# EAGLE design Motherboard (EAGLE 9.3.1)
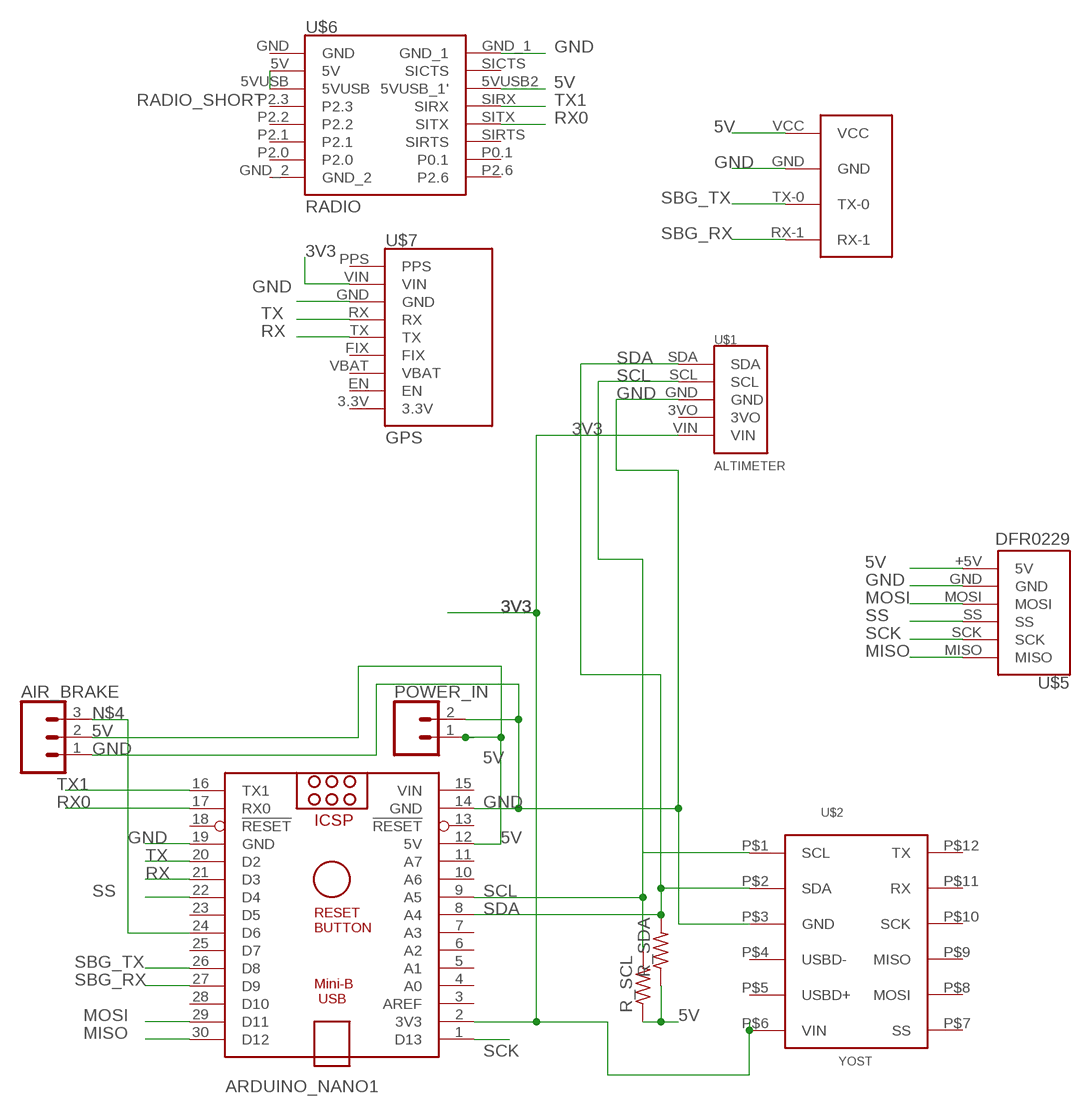
[diagram p0: schematic, sheet 1]

## Parts
AIR_BRAKE  CONN_03  [1X03]
ARDUINO_NANO1  ARDUINO_NANO  [ARDUINO_NANO]
POWER_IN  CONN_023.5MM  [SCREWTERMINAL-3.5MM-2]
R_SCL  R-US_R0603  [R0603]
R_SDA  R-US_R0603  [R0603]
U$1  ALTIMETER  [ALTIMETER]
U$2  YOST  [YOST]
U$3  RS232  [RS232]
U$5  DFR0229  [DFR0229]
U$6  RADIO  [RADIO]
U$7  GPS  [GPS]

## Nets
3V3: ARDUINO_NANO1.2(3V3) U$1.VIN U$2.P$6(VIN) U$7.VIN
5V: AIR_BRAKE.2 ARDUINO_NANO1.12(5V) POWER_IN.1 R_SCL.1 R_SDA.1 U$3.VCC U$5.+5V(5V) U$6.5VUSB2(5VUSB_1')
GND: AIR_BRAKE.1 ARDUINO_NANO1.14(GND) ARDUINO_NANO1.19(GND) POWER_IN.2 U$1.GND U$2.P$3(GND) U$3.GND U$5.GND U$6.GND_1 U$7.GND
MISO: ARDUINO_NANO1.30(D12) U$5.MISO
MOSI: ARDUINO_NANO1.29(D11) U$5.MOSI
N$4: AIR_BRAKE.3 ARDUINO_NANO1.24(D6)
RADIO_SHORT: U$6.5V U$6.5VUSB
RX: ARDUINO_NANO1.21(D3) U$7.TX
RX0: ARDUINO_NANO1.17(RX0) U$6.SITX
SBG_RX: ARDUINO_NANO1.27(D9) U$3.RX-1
SBG_TX: ARDUINO_NANO1.26(D8) U$3.TX-0
SCK: ARDUINO_NANO1.1(D13) U$5.SCK
SCL: ARDUINO_NANO1.9(A5) R_SCL.2 U$1.SCL U$2.P$1(SCL)
SDA: ARDUINO_NANO1.8(A4) R_SDA.2 U$1.SDA U$2.P$2(SDA)
SS: ARDUINO_NANO1.22(D4) U$5.SS
TX: ARDUINO_NANO1.20(D2) U$7.RX
TX1: ARDUINO_NANO1.16(TX1) U$6.SIRX
Unconnected: ARDUINO_NANO1.3(AREF) ARDUINO_NANO1.4(A0) ARDUINO_NANO1.5(A1) ARDUINO_NANO1.6(A2) ARDUINO_NANO1.7(A3) ARDUINO_NANO1.10(A6) ARDUINO_NANO1.11(A7) ARDUINO_NANO1.13(!RESET) ARDUINO_NANO1.18(!RESET) ARDUINO_NANO1.23(D5) ARDUINO_NANO1.25(D7) ARDUINO_NANO1.28(D10) U$1.3VO U$2.P$4(USBD-) U$2.P$5(USBD+) U$2.P$7(SS) U$2.P$8(MOSI) U$2.P$9(MISO) U$2.P$10(SCK) U$2.P$11(RX) U$2.P$12(TX) U$6.GND U$6.GND_2 U$6.P0.1 U$6.P2.0 U$6.P2.1 U$6.P2.2 U$6.P2.3 U$6.P2.6 U$6.SICTS U$6.SIRTS U$7.3.3V U$7.EN U$7.FIX U$7.PPS U$7.VBAT

## Power pins joined to a net without a drawn wire
VIN: ARDUINO_NANO1.15(VIN)

## Library data of the parts
AIR_BRAKE = SparkFun-Connectors:CONN_03: Multi connection point. Often used as Generic Header-pin footprint for 0.1 inch spaced/style header connections On any of the 0.1 inch spaced packages, you can populate with these: Break Away Headers - Straight <https://www.sparkfun.com/products/116> (PRT-00116) Break Away Male Headers - Right Angle <https://www.sparkfun.com/products/553> (PRT-00553) Female Headers <https://www.sparkfun.com/products/115> (PRT-00115) Break Away Headers - Machine Pin <https://www.sparkfun.com/products/117> (PRT-00117) Break Away Female Headers - Swiss Machine Pin <https://www.sparkfun.com/products/743> (PRT-00743) Stackable Header - 3 Pin (Female, 0.1") <https://www.sparkfun.com/products/13875> (PRT-13875) For SCREWTERMINALS and SPRING TERMINALS visit here: Screw Terimnals on SparkFun.com <https://www.sparkfun.com/search/results?term=Screw+Terminals> (5mm/3.5mm/2.54mm spacing) This device is also useful as a general connection point to wire up your design to another part of your project. Our various solder wires solder well into these plated through hole pads. Hook-Up Wire - Assortment (Stranded, 22 AWG) <https://www.sparkfun.com/products/11375> (PRT-11375) Hook-Up Wire - Assortment (Solid Core, 22 AWG) <https://www.sparkfun.com/products/11367> (PRT-11367) View the entire wire category on our website here <https://www.sparkfun.com/categories/141> Special notes: Molex polarized connector foot print use with SKU : PRT-08232 with associated crimp pins and housings.; PROD_ID: XXX-00000; VALUE: 455-1750-1-ND
ARDUINO_NANO1 = ArduinoNanoV30:ARDUINO_NANO: Arduino Nano V3.0 Overview: The Arduino Nano is a small, complete, and breadboard-friendly board based on the ATmega328 (Arduino Nano 3.x) or ATmega168 (Arduino Nano 2.x). It has more or less the same functionality of the Arduino Duemilanove, but in a different package. It lacks only a DC power jack, and works with a Mini-B USB cable instead of a standard one. The Nano was designed and is being produced by Gravitech. Specifications: Microcontroller Atmel ATmega168 or ATmega328 Operating Voltage (logic level) 5 V Input Voltage (recommended) 7-12 V Input Voltage (limits) 6-20 V Digital I/O Pins 14 (of which 6 provide PWM output) Analog Input Pins 8 DC Current per I/O Pin 40 mA Flash Memory 16 KB (ATmega168) or 32 KB (ATmega328) of which 2 KB used by bootloader SRAM 1 KB (ATmega168) or 2 KB (ATmega328) EEPROM 512 bytes (ATmega168) or 1 KB (ATmega328) Clock Speed 16 MHz Dimensions 0.73" x 1.70" Length 45 mm Width 18 mm Weigth 5 g Power: The Arduino Nano can be powered via the Mini-B USB connection, 6-20V unregulated external power supply (pin 30), or 5V regulated external power supply (pin 27). The power source is automatically selected to the highest voltage source. Memory: The ATmega168 has 16 KB of flash memory for storing code (of which 2 KB is used for the bootloader); the ATmega328 has 32 KB, (also with 2 KB used for the bootloader). The ATmega168 has 1 KB of SRAM and 512 bytes of EEPROM (which can be read and written with the EEPROM library); the ATmega328 has 2 KB of SRAM and 1 KB of EEPROM. Input and Output: Each of the 14 digital pins on the Nano can be used as an input or output, using pinMode(), digitalWrite(), and digitalRead() functions. They operate at 5 volts. Each pin can provide or receive a maximum of 40 mA and has an internal pull-up resistor (disconnected by default) of 20-50 kOhms. In addition, some pins have specialized functions. Visit Arduino - ArduinoBoardNano <https://www.arduino.cc/en/Main/ArduinoBoardNano>
POWER_IN = SparkFun-Connectors:CONN_02: Multi connection point. Often used as Generic Header-pin footprint for 0.1 inch spaced/style header connections On any of the 0.1 inch spaced packages, you can populate with these: Break Away Headers - Straight <https://www.sparkfun.com/products/116> (PRT-00116) Break Away Male Headers - Right Angle <https://www.sparkfun.com/products/553> (PRT-00553) Female Headers <https://www.sparkfun.com/products/115> (PRT-00115) Break Away Headers - Machine Pin <https://www.sparkfun.com/products/117> (PRT-00117) Break Away Female Headers - Swiss Machine Pin <https://www.sparkfun.com/products/743> (PRT-00743) For SCREWTERMINALS and SPRING TERMINALS visit here: Screw Terimnals on SparkFun.com <https://www.sparkfun.com/search/results?term=Screw+Terminals> (5mm/3.5mm/2.54mm spacing) This device is also useful as a general connection point to wire up your design to another part of your project. Our various solder wires solder well into these plated through hole pads. Hook-Up Wire - Assortment (Stranded, 22 AWG) <https://www.sparkfun.com/products/11375> (PRT-11375) Hook-Up Wire - Assortment (Solid Core, 22 AWG) <https://www.sparkfun.com/products/11367> (PRT-11367) View the entire wire category on our website here <https://www.sparkfun.com/categories/141> Special notes: Molex polarized connector foot print use with: PRT-08233 with associated crimp pins and housings. 2.54_SCREWTERM for use with PRT-10571. 3.5mm Screw Terminal footprints for PRT-08084 5mm Screw Terminal footprints for use with PRT-08432; PROD_ID: CONN-08399
R_SCL R_SDA = rcl:R-US_: RESISTOR, American symbol; SPICEPREFIX: R
U$1 = uORocketry-parts:ALTIMETER
U$2 = ArduinoNanoV30:YOST
U$3 = uORocketry-parts:RS232
U$5 = uORocketry-parts:DFR0229
U$6 = uORocketry-parts:RADIO
U$7 = uORocketry-parts:GPS: Adafruit ultimate GPS breakout

## Board
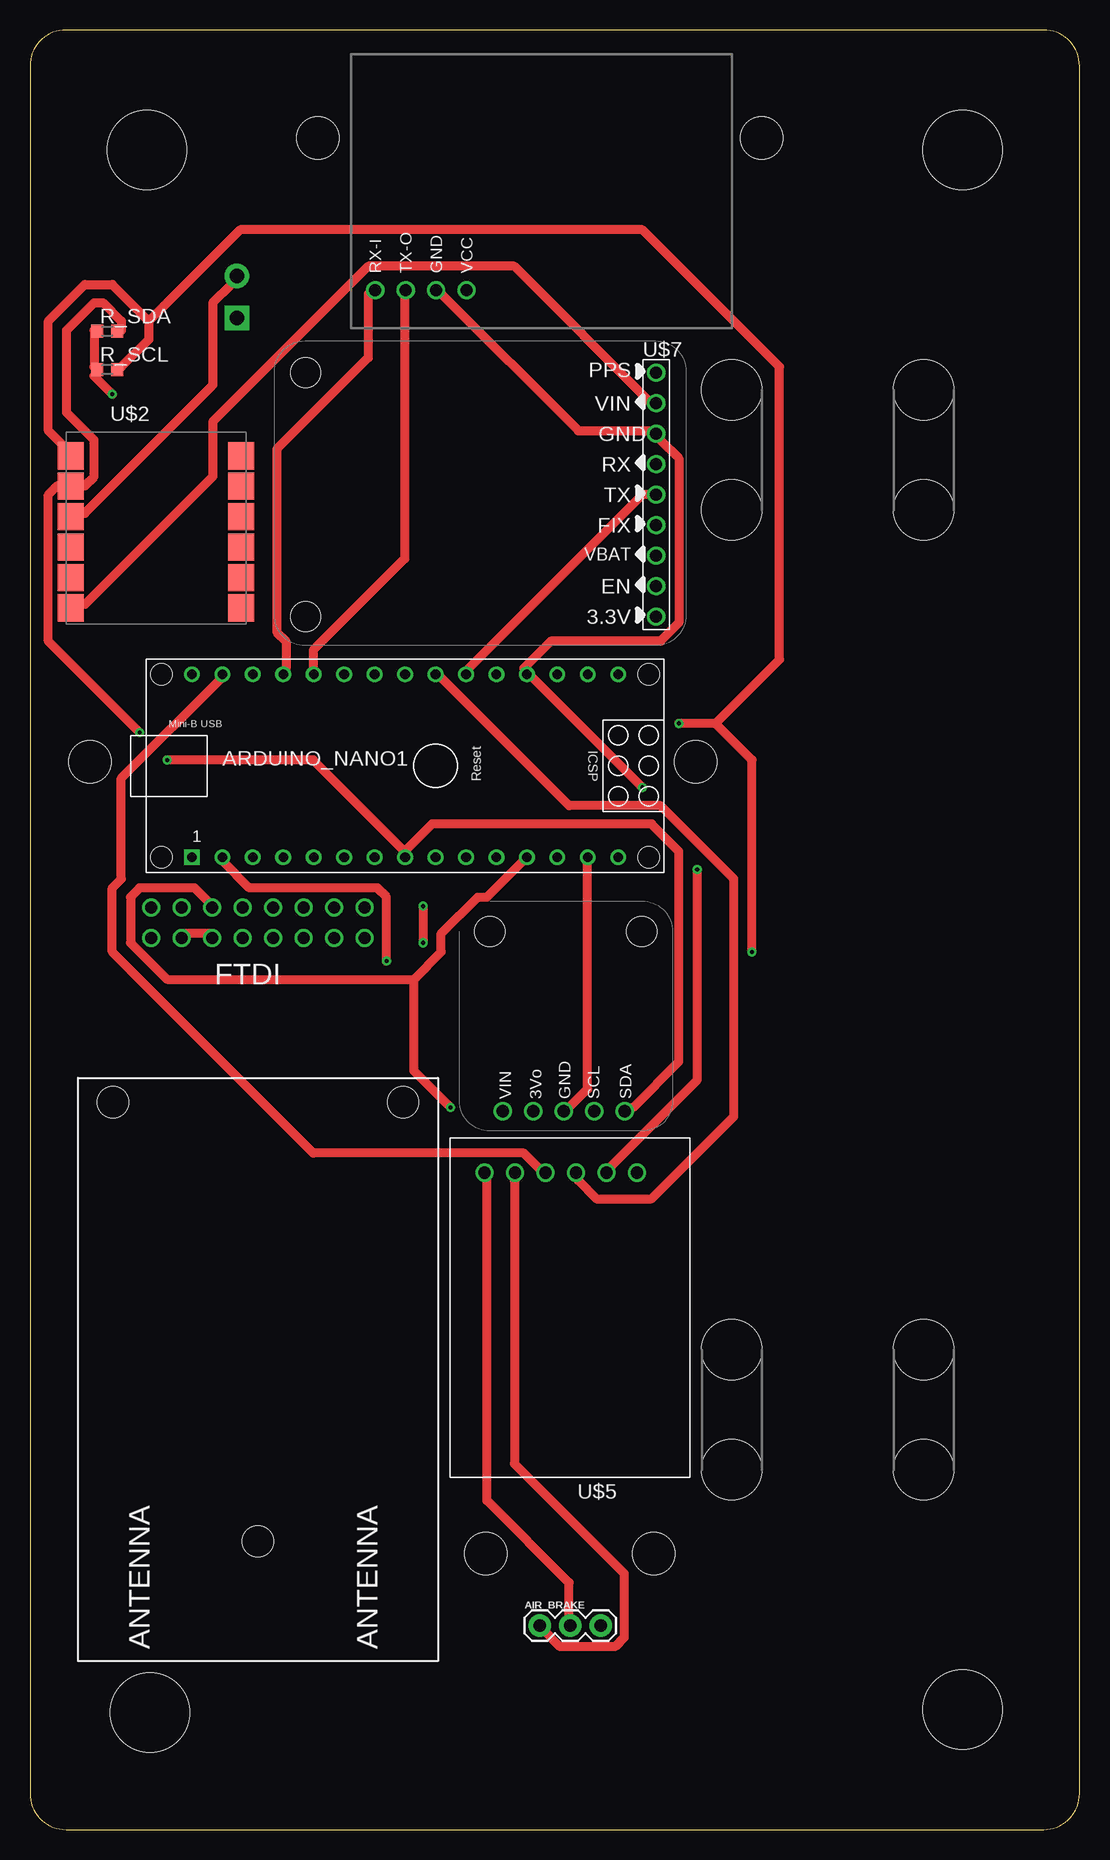
[diagram p1: board, top side]
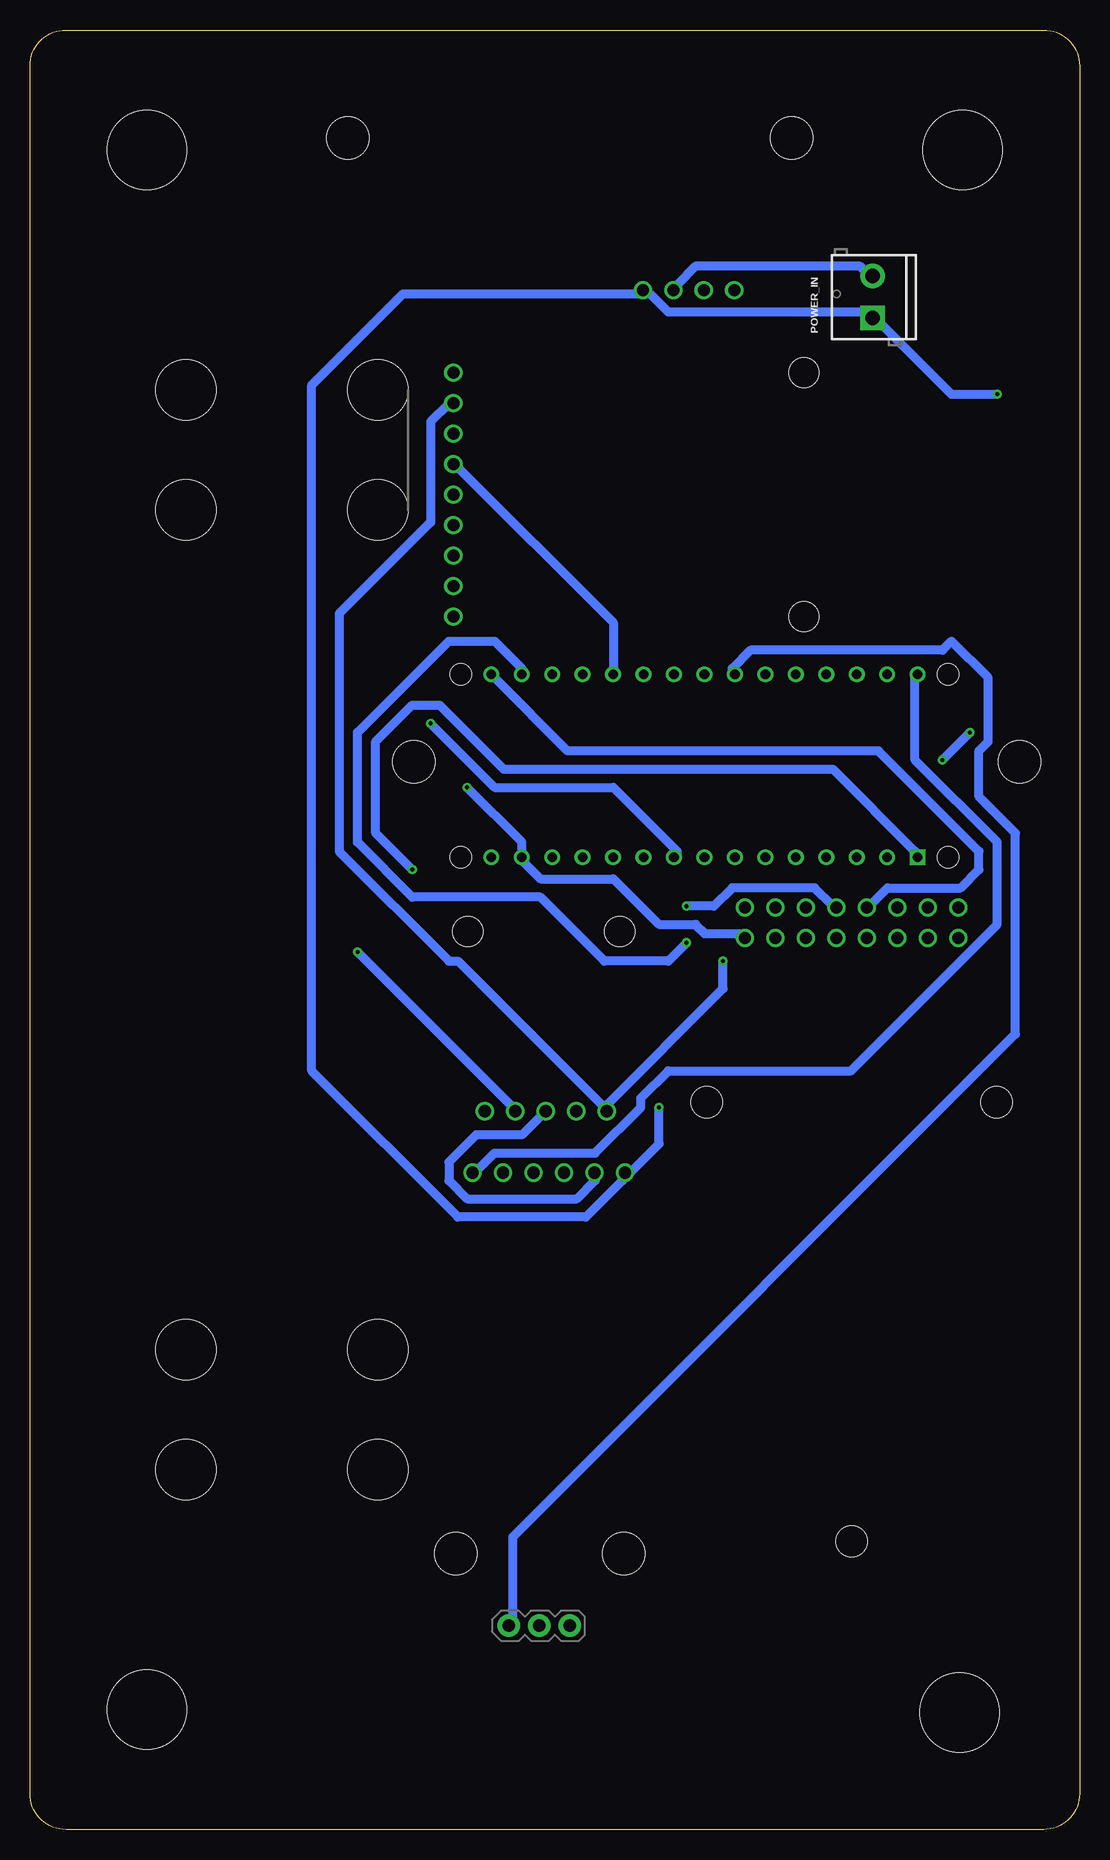
[diagram p2: board, bottom side, seen from below]

Size 87.5 x 150 mm. Coordinates in mm from the lower left corner, seen from the top.
Outline: 3,0 84.5,0 arc90 87.5,3 87.5,147 arc90 84.5,150 3,150 arc90 0,147 0,3 arc90 3,0
Copper layers (1*16): Top 0.035mm / dielectric 1.5mm / Bottom 0.035mm
Design rules "default *": minimum track width 30mil, minimum drill 0.35mm, track to track 30mil, track to pad 12mil, pad to pad 12mil, via to via 12mil, smd to smd 12mil, copper to edge 30mil, drill to drill 12mil, minimum pad ring 10mil, minimum via ring 8mil, stop-mask expansion 4mil, vias tented up to drill 0mil, thermal gap 10mil
Holes 6.6 mm at 9.75,140 10,9.75 77.75,10 77.75,140
Holes 3.54 mm at 52,23 38,23 5,89 55.5,89 24,141 61,141
Holes 5 mm at 58.5,40 58.5,30 74.5,40 74.5,30 58.5,120 74.5,120 74.5,110 58.5,110

### Footprints (pad centres in the part's own frame; a part is rotated, then mirrored left to right if it is on the bottom)
1X03 = drill 1.016 pad 1.88: 1 0,0; 2 2.54,0; 3 5.08,0
ARDUINO_NANO = drill 0.8 square: 1 -20.32,-7.62 | drill 0.8: 2 -17.78,-7.62; 3 -15.24,-7.62; 4 -12.7,-7.62; 5 -10.16,-7.62; 6 -7.62,-7.62; 7 -5.08,-7.62; 8 -2.54,-7.62; 9 0,-7.62; 10 2.54,-7.62; 11 5.08,-7.62; 12 7.62,-7.62; 13 10.16,-7.62; 14 12.7,-7.62; 15 15.24,-7.62; 16 15.24,7.62; 17 12.7,7.62; 18 10.16,7.62; 19 7.62,7.62; 20 5.08,7.62; 21 2.54,7.62; 22 0,7.62; 23 -2.54,7.62; 24 -5.08,7.62; 25 -7.62,7.62; 26 -10.16,7.62; 27 -12.7,7.62; 28 -15.24,7.62; 29 -17.78,7.62; 30 -20.32,7.62 | hole 1.778: -22.86,-7.62; -22.86,7.62; 17.78,7.62; 17.78,-7.62
SCREWTERMINAL-3.5MM-2 = drill 1.2 pad 2.032 square: 1 0,0 | drill 1.2 pad 2.032: 2 3.5,0
R0603 = smd 1 x 1.1: 1 -0.85,0; 2 0.85,0
ALTIMETER = drill 1.016: 3VO 7.62,-2.54; GND 7.62,0; SCL 7.62,2.54; SDA 7.62,5.08; VIN 7.62,-5.08 | hole 2.5: -7.347,6.5; -7.347,-6.16
YOST = smd 2.159 x 2.286: P$1 -7.112,6.017; P$2 -7.112,3.477; P$3 -7.112,0.937; P$4 -7.112,-1.603; P$5 -7.112,-4.143; P$6 -7.112,-6.683; P$7 7.112,-6.683; P$8 7.112,-4.143; P$9 7.112,-1.603; P$10 7.112,0.937; P$11 7.112,3.477; P$12 7.112,6.017
RS232 = drill 1.016: GND 19.685,7.112; RX-1 19.685,2.032; TX-0 19.685,4.572; VCC 19.685,9.652
DFR0229 = drill 1.016: +5V 7.1,-11.25; GND 4.56,-11.25; MISO -5.6,-11.25; MOSI 2.02,-11.25; SCK -3.06,-11.25; SS -0.52,-11.25
RADIO = drill 1.016: 5V 50.31,6.35; 5VUSB 50.31,3.81; 5VUSB2 52.85,3.81; GND 50.31,8.89; GND_1 50.31,-8.89; GND_2 52.85,8.89; P0.1 52.85,-6.35; P2.0 50.31,-6.35; P2.1 50.31,-3.81; P2.2 50.31,-1.27; P2.3 50.31,1.27; P2.6 52.85,-8.89; SICTS 52.85,6.35; SIRTS 52.85,-3.81; SIRX 52.85,1.27; SITX 52.85,-1.27 | hole 2.6: 0.02,0; 36.63,12.1; 36.63,-12.1
GPS = drill 1.016: 3.3V 14.7,-10.89; EN 14.7,-8.35; FIX 14.7,-3.27; GND 14.7,4.35; PPS 14.7,9.43; RX 14.7,1.81; TX 14.7,-0.73; VBAT 14.7,-5.81; VIN 14.7,6.89 | hole 2.5: -14.51,9.43; -14.51,-10.89

### Placement (x,y rotation side)
AIR_BRAKE  42.5,17 0 top
ARDUINO_NANO1  33.81,88.66 0 top
POWER_IN  17.25,126 90 bottom
R_SCL  6.44,121.7 0 top
R_SDA  6.44,124.89 0 top
U$1  44.5,67.5 270 top
U$2  10.5,108.5 0 top
U$3  26.75,148 270 top
U$5  45,43.5 180 top
U$6  19,24 90 top
U$7  37.5,112 0 top

### Tracks (layer width: path | path; a pad name or v marks a point on that pad's centre or on a via)
3V3  (via drill 0.35)
  Top 0.762: v29.72,72.39 29.72,77.72 28.96,78.49 18.29,78.49 16,80.77 ARDUINO_NANO1.2 | U$2.P$6 3.81,102.11 4.57,102.11 15.24,112.78 15.24,117.35 28.19,130.3 40.39,130.3 51.82,118.87 U$7.VIN
  Bottom 0.762: v29.72,72.39 29.72,70.1 39.62,60.2 | 39.62,60.2 51.82,72.39 52.58,72.39 61.72,81.53 61.72,101.35 54.1,108.97 54.1,117.35 52.58,118.87 U$7.VIN | 39.62,60.2 U$1.VIN
5V  (via drill 0.35)
  Top 0.762: 32,70.87 34.29,73.15 34.29,74.68 37.34,77.72 38.1,77.72 41.15,80.77 ARDUINO_NANO1.12 | 32,70.87 11.43,70.87 8.38,73.91 8.38,77.72 9.14,78.49 13.72,78.49 15.24,76.96 U$6.5VUSB2 | R_SDA.1 5.33,124.97 5.33,121.92 R_SCL.1 5.33,121.16 v6.86,119.63 | U$5.+5V 38.1,54.1 38.1,27.43 44.96,20.57 44.96,17.53 AIR_BRAKE.2 | 32,70.87 32,63.25 v35.05,60.2
  Bottom 0.762: v6.86,119.63 10.67,119.63 16.76,125.73 POWER_IN.1 17.53,126.49 34.29,126.49 35.81,128.02 U$3.VCC 36.58,128.02 56.39,128.02 64.01,120.4 64.01,63.25 51.82,51.05 41.15,51.05 38.1,54.1 U$5.+5V 37.34,54.86 35.05,57.15 v35.05,60.2
GND  (via drill 0.35)
  Top 0.762: U$2.P$3 3.81,109.73 4.57,109.73 15.24,120.4 15.24,127.25 16.76,128.78 POWER_IN.2 | U$3.GND 34.29,128.02 45.72,116.59 51.82,116.59 U$7.GND 52.58,115.82 54.1,114.3 54.1,100.58 52.58,99.06 43.43,99.06 41.15,96.77 ARDUINO_NANO1.19 41.91,96.01 v51.05,86.87 | ARDUINO_NANO1.14 46.48,80.77 46.48,61.72 44.96,60.2 U$1.GND | AIR_BRAKE.1 42.67,16.76 44.2,15.24 48.77,15.24 49.53,16 49.53,21.34 40.39,30.48 40.39,54.1 U$5.GND
  Bottom 0.762: U$3.GND 33.53,128.78 32,130.3 18.29,130.3 17.53,129.54 POWER_IN.2 | U$5.GND 40.39,54.1 41.91,52.58 51.05,52.58 52.58,54.1 52.58,55.63 50.29,57.91 46.48,57.91 44.96,59.44 U$1.GND | U$6.GND_1 28.19,74.68 31.24,74.68 32,75.44 35.05,75.44 38.86,79.25 44.96,79.25 46.48,80.77 ARDUINO_NANO1.14 46.48,81.53 46.48,82.3 v51.05,86.87
MISO
  Bottom 0.762: ARDUINO_NANO1.30 13.72,96.01 13.72,89.15 6.86,82.3 6.86,75.44 19.05,63.25 34.29,63.25 36.58,60.96 36.58,60.2 40.39,56.39 48.77,56.39 50.29,54.86 U$5.MISO
MOSI
  Top 0.762: ARDUINO_NANO1.29 16,96.01 7.62,87.63 7.62,79.25 6.86,78.49 6.86,73.15 23.62,56.39 41.15,56.39 42.67,54.86 U$5.MOSI
N$4
  Bottom 0.762: ARDUINO_NANO1.24 28.96,96.77 27.43,98.3 11.43,98.3 10.67,99.06 7.62,96.01 7.62,90.68 8.38,89.92 8.38,86.11 5.33,83.06 5.33,66.29 47.24,24.38 47.24,17.53 AIR_BRAKE.3
RADIO_SHORT
  Top 0.762: U$6.5V 12.95,74.68 15.24,74.68 U$6.5VUSB
RX
  Top 0.762: ARDUINO_NANO1.21 36.58,96.77 51.05,111.25 51.82,111.25 U$7.TX
RX0  (via drill 0.35)
  Top 0.762: v32.77,76.96 v32.77,73.91
  Bottom 0.762: v32.77,73.91 34.29,72.39 39.62,72.39 44.96,77.72 55.63,77.72 60.2,82.3 60.2,91.44 52.58,99.06 48.77,99.06 46.48,96.77 ARDUINO_NANO1.17 | v32.77,76.96 30.48,76.96 28.96,78.49 22.1,78.49 20.57,76.96 U$6.SITX
SBG_RX
  Top 0.762: ARDUINO_NANO1.27 21.34,96.77 21.34,99.06 20.57,99.82 20.57,115.06 28.19,122.68 28.19,128.02 U$3.RX-1
SBG_TX
  Top 0.762: ARDUINO_NANO1.26 23.62,96.77 23.62,98.3 31.24,105.92 31.24,128.02 U$3.TX-0
SCK  (via drill 0.35)
  Top 0.762: v55.63,80.01 55.63,62.48 48.01,54.86 U$5.SCK
  Bottom 0.762: v55.63,80.01 58.67,83.06 58.67,90.68 55.63,93.73 53.34,93.73 48.01,88.39 20.57,88.39 13.72,81.53 ARDUINO_NANO1.1
SCL  (via drill 0.35)
  Top 0.762: 9.91,125.73 9.91,124.21 7.62,121.92 R_SCL.2 | 9.91,125.73 6.86,128.78 4.57,128.78 1.52,125.73 1.52,116.59 3.05,115.06 U$2.P$1 | 57.15,92.2 v54.1,92.2 | 57.15,92.2 60.2,89.15 v60.2,73.15 | 9.91,125.73 17.53,133.35 51.05,133.35 62.48,121.92 62.48,97.54 57.15,92.2
  Bottom 0.762: v54.1,92.2 48.77,86.87 38.86,86.87 33.53,81.53 ARDUINO_NANO1.9 | v60.2,73.15 47.24,60.2 U$1.SCL
SDA  (via drill 0.35)
  Top 0.762: R_SDA.2 7.62,124.97 7.62,125.73 6.1,127.25 5.33,127.25 3.05,124.97 3.05,118.11 5.33,115.82 5.33,112.78 4.57,112.01 3.81,112.01 U$2.P$2 3.05,112.01 2.29,112.01 1.52,111.25 1.52,99.06 v9.14,91.44 | 31.24,81.53 33.53,83.82 51.82,83.82 54.1,81.53 54.1,64.01 50.29,60.2 U$1.SDA | v11.43,89.15 23.62,89.15 31.24,81.53 | 31.24,81.53 ARDUINO_NANO1.8
  Bottom 0.762: v11.43,89.15 v9.14,91.44
SS
  Top 0.762: ARDUINO_NANO1.22 34.29,96.01 44.96,85.34 52.58,85.34 58.67,79.25 58.67,59.44 51.82,52.58 47.24,52.58 45.72,54.1 U$5.SS
TX
  Bottom 0.762: ARDUINO_NANO1.20 38.86,96.77 38.86,100.58 52.14,113.87 U$7.RX
TX1
  Bottom 0.762: ARDUINO_NANO1.16 48.77,96.01 42.67,89.92 16.76,89.92 8.38,81.53 8.38,80.01 9.91,78.49 16,78.49 17.53,76.96 U$6.SIRX

### Text on the board
bDocu: - | + | AIR BRAKE | DATA | - | +